# EAGLE schematic system-diagram (EAGLE 9.5.2)
REVISION: 1.0; SCH_DESC: Breakout board for the LSM9DS1; TEAM: RoboCup
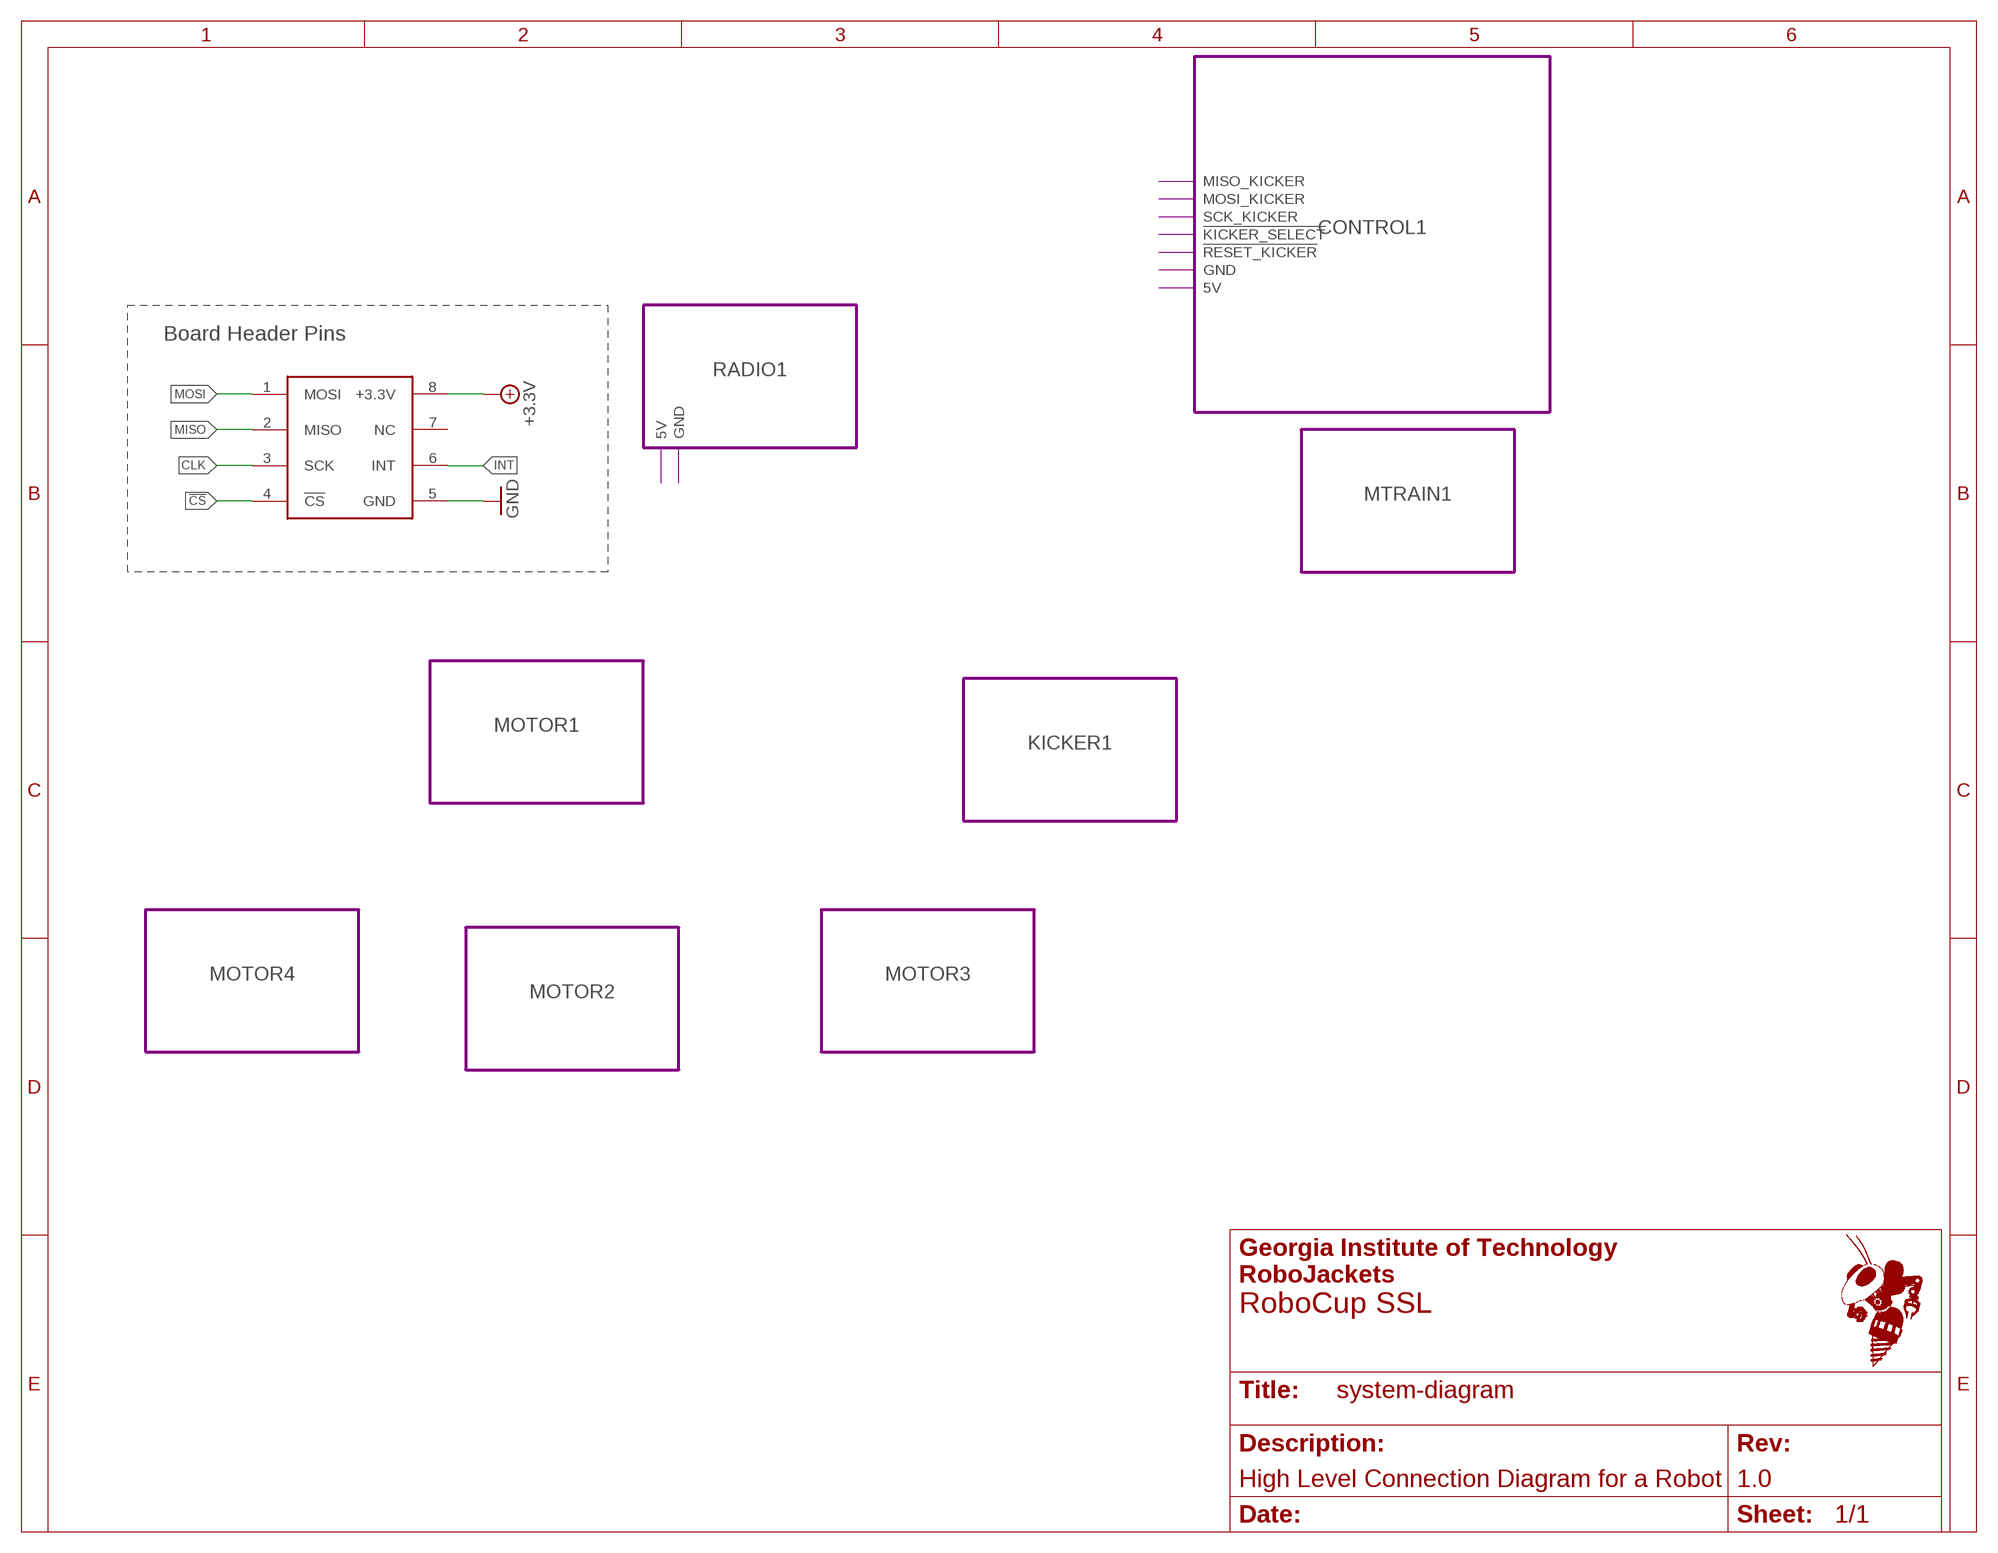
[diagram p0: schematic, sheet 1]
FRAME1 (FRAME_A_L): REVISION: 1.0; SCH_DESC: High Level Connection Diagram for a Robot; TEAM: RoboCup SSL

## Parts
KIT1  IMUIMU-KIT  [IMU-KIT]

## Module instances
RADIO1 = RADIO
KICKER1 = KICKER
MOTOR1 = MOTOR
MOTOR2 = MOTOR
MOTOR3 = MOTOR
MOTOR4 = MOTOR
CONTROL1 = CONTROL
MTRAIN1 = MTRAIN

## Nets
!CS!: KIT1.4(!CS!)
+3.3V: KIT1.8(+3.3V)
CLK: KIT1.3(SCK)
GND: KIT1.5(GND)
INT: KIT1.6(INT)
MISO: KIT1.2(MISO)
MOSI: KIT1.1(MOSI)
Unconnected: KIT1.7(NC)

## Notes on the sheet
- Board Header Pins

## Library data of the parts
KIT1 = RoboJackets-Boards:IMU: IMU breakout board

## Module RADIO
Ports: 5V(io) GND(io)

### Library data of the parts

## Module KICKER
Ports: 

### Library data of the parts

## Module MOTOR
Ports: 

### Library data of the parts

## Module CONTROL
Ports: MISO_KICKER(io) MOSI_KICKER(io) SCK_KICKER(io) !KICKER_SELECT(io) !RESET_KICKER(io) GND(io) 5V(io)

### Library data of the parts

## Module MTRAIN
Ports: 

### Library data of the parts